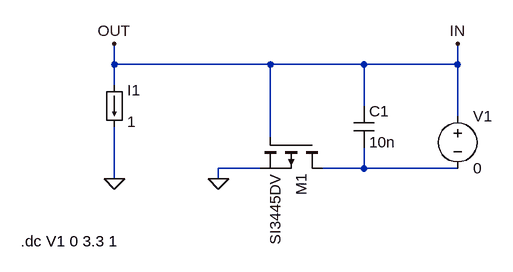
[diagram p0: schematic ltspice_batery_switch.asc]
ltspice_batery_switch.asc, the LTspice schematic file:
Version 4
SHEET 1 956 680
WIRE 240 -128 240 -160
WIRE 480 -128 240 -128
WIRE 624 -128 480 -128
WIRE 768 -128 768 -160
WIRE 768 -128 624 -128
WIRE 240 -96 240 -128
WIRE 624 -64 624 -128
WIRE 768 -48 768 -128
WIRE 480 -16 480 -128
WIRE 464 32 400 32
WIRE 624 32 624 0
WIRE 624 32 560 32
WIRE 768 32 624 32
WIRE 240 48 240 -32
WIRE 400 48 400 32
FLAG 240 -160 OUT
FLAG 768 -160 IN
FLAG 400 48 0
FLAG 240 48 0
SYMBOL voltage 768 -64 R0
SYMATTR InstName V1
SYMATTR Value 0
SYMBOL pmos 560 -16 R90
SYMATTR InstName M1
SYMATTR Value SI3445DV
SYMBOL cap 608 -64 R0
SYMATTR InstName C1
SYMATTR Value 10n
SYMATTR SpiceLine Rser=0 Lser=0 mfg="Murata" pn="GCM155R71E103KA37" type="X7R"
SYMBOL load 224 -96 R0
SYMATTR InstName I1
SYMATTR Value 1
TEXT 96 144 Left 2 !.dc V1 0 3.3 1

The netlist it stands for:
* ltspice_batery_switch.asc
V1 IN N001 0
M1 N001 IN 0 0 SI3445DV
C1 IN N001 10n Rser=0 Lser=0 mfg="Murata" pn="GCM155R71E103KA37" type="X7R"
I1 IN 0 1
.model NMOS NMOS
.model PMOS PMOS
.lib standard.mos
.dc V1 0 3.3 1
.backanno
.end